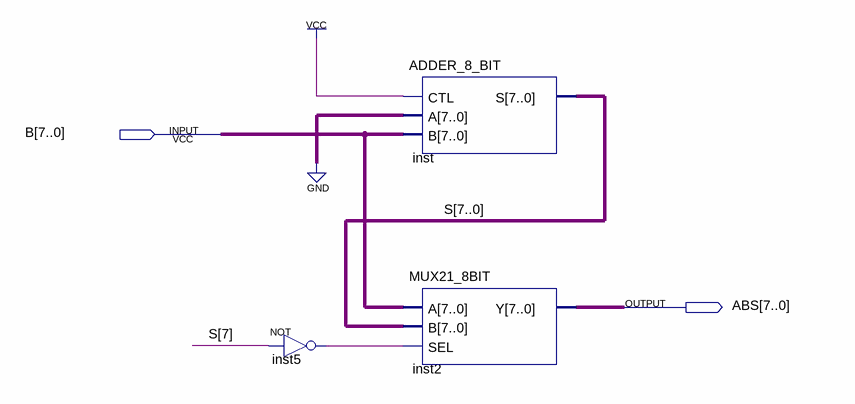
[diagram p0: schematic sheet]
// Quartus schematic ABS_UNIT.bdf as structural Verilog: 3 symbols, 2 pins
module ABS_UNIT (
  input  [7:0] B,
  output [7:0] ABS
);

  wire inst5_out;
  wire [7:0] S;

  not inst5 (inst5_out, S[7]);
  ADDER_8_BIT inst (.CTL(1'b1), .A({8{1'b0}}), .B(B), .S(S));
  MUX21_8BIT inst2 (.A(B), .B(S), .SEL(inst5_out), .Y(ABS));
endmodule
